# EAGLE design Temalab (EAGLE 9.2.2)
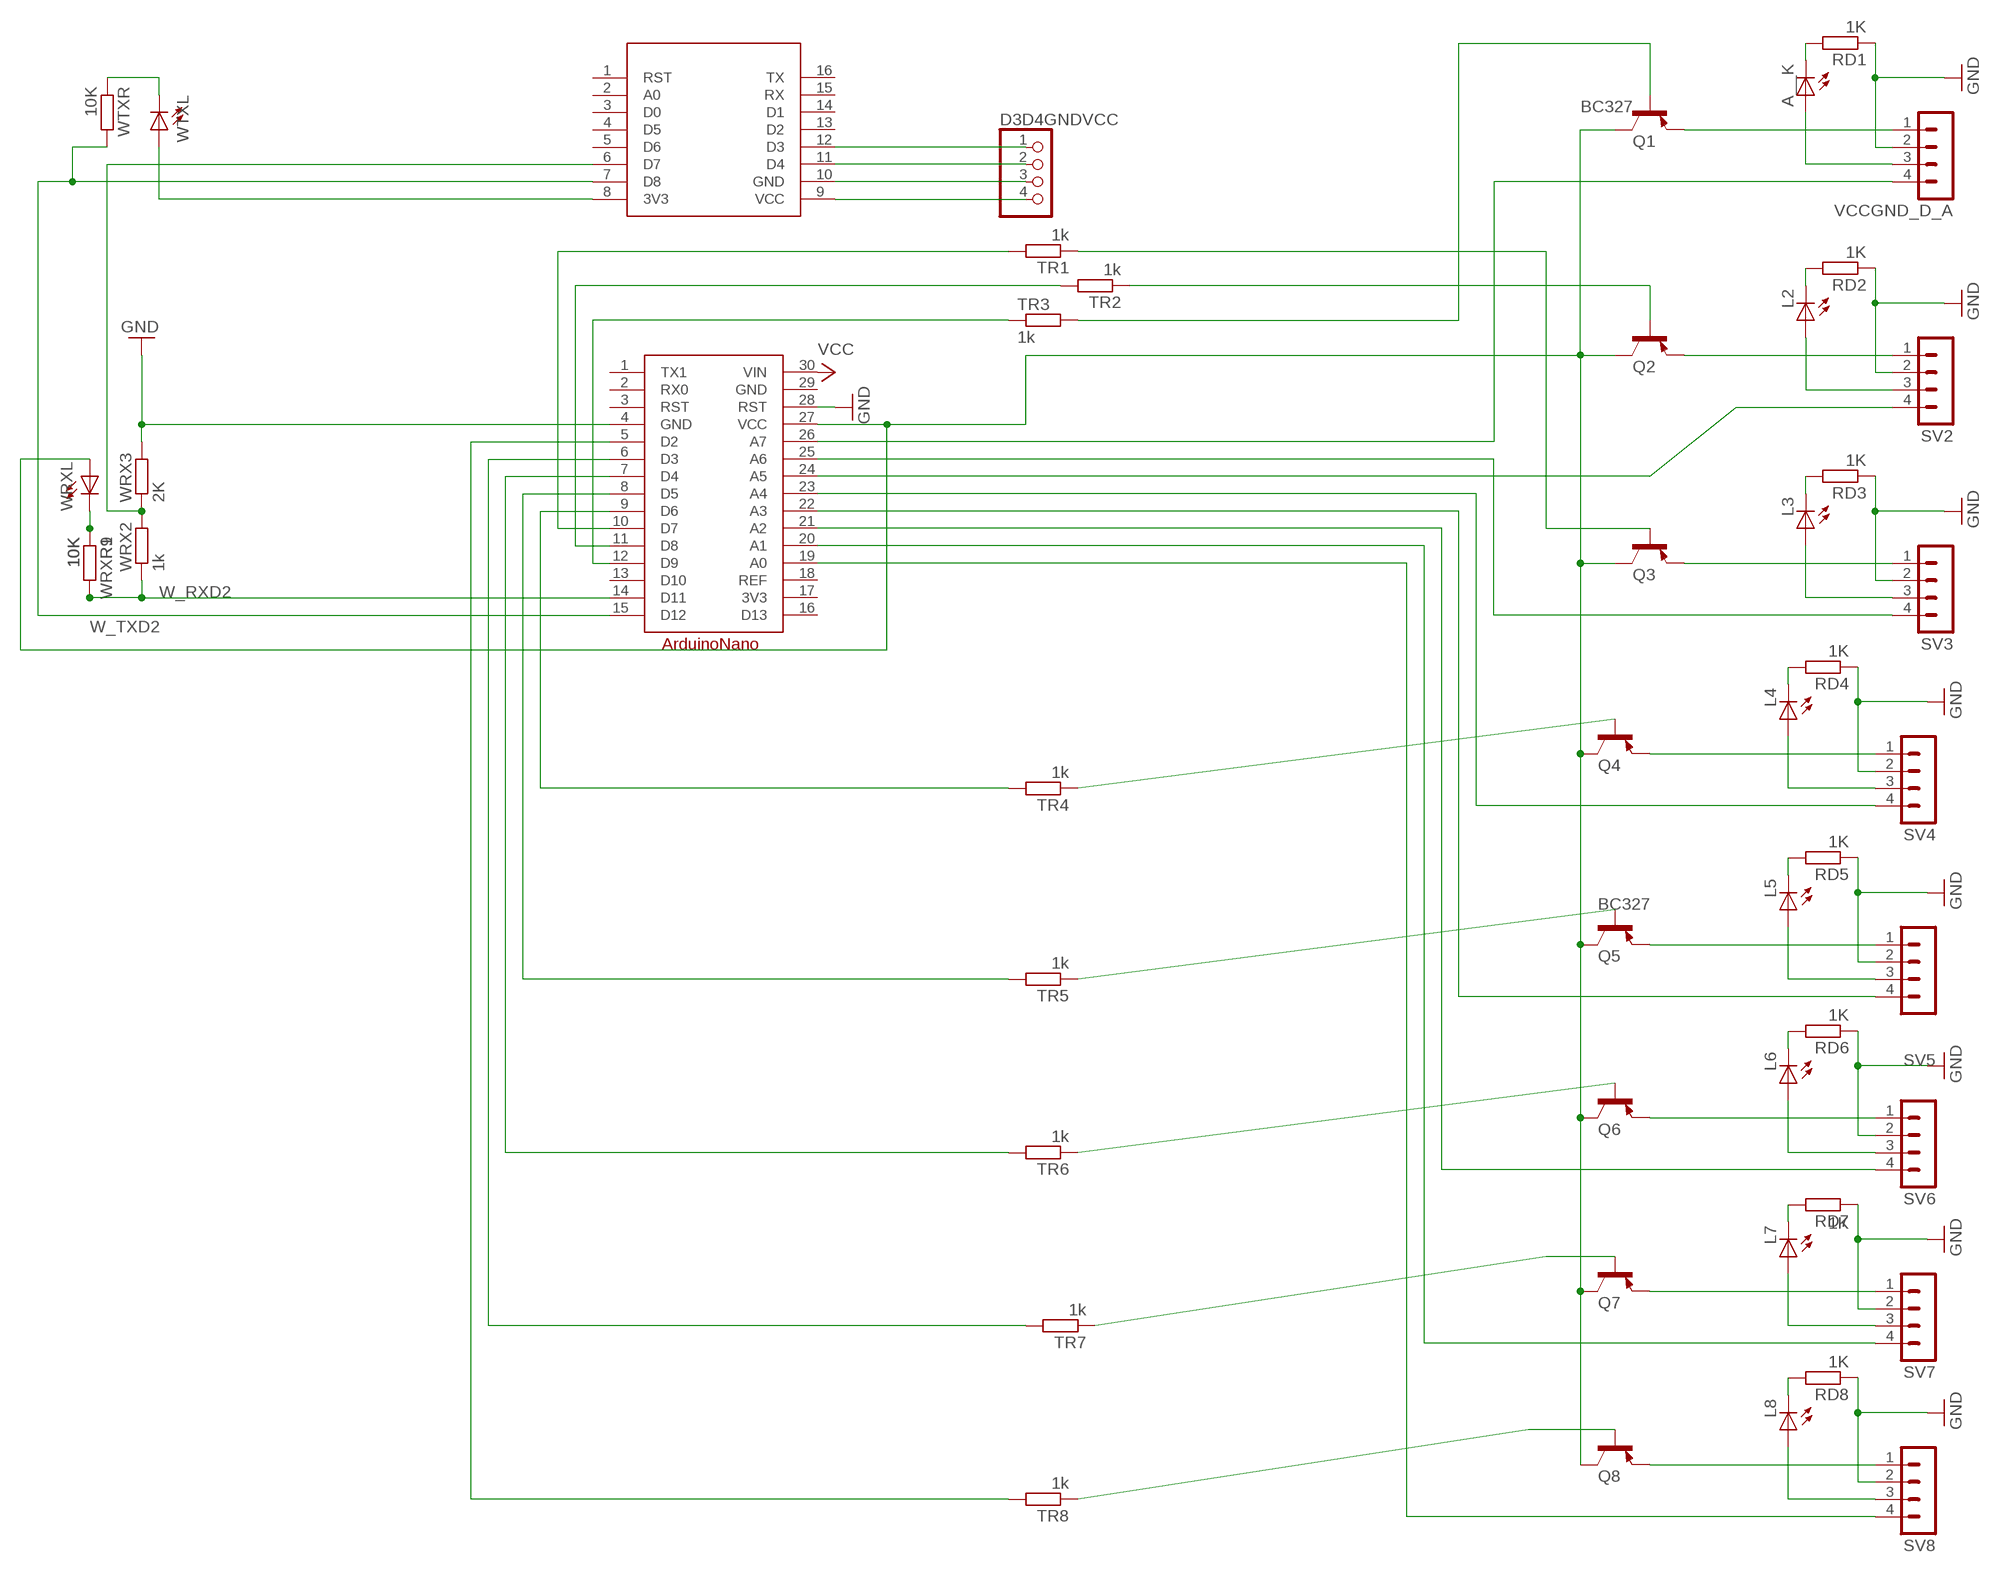
[diagram p0: schematic, sheet 1]

## Parts
A1  ARDUINONANO  [ARDUINONANO]
A__K  TLLR4400  [LED3MM]
D3D4GNDVCC  PINHD-1X4  [1X04]
L2  TLLR4400  [LED3MM]
L3  TLLR4400  [LED3MM]
L4  TLLR4400  [LED3MM]
L5  TLLR4400  [LED3MM]
L6  TLLR4400  [LED3MM]
L7  TLLR4400  [LED3MM]
L8  TLLR4400  [LED3MM]
Q1  BC327  [TO92]
Q2  BC327  [TO92]
Q3  BC327  [TO92]
Q4  BC327  [TO92]
Q5  BC327  [TO92]
Q6  BC327  [TO92]
Q7  BC327  [TO92]
Q8  BC327  [TO92]
R9  10K  R-EU_0204/2V  [0204V]
RD1  1K  R-EU_0204/2V  [0204V]
RD2  1K  R-EU_0204/2V  [0204V]
RD3  1K  R-EU_0204/2V  [0204V]
RD4  1K  R-EU_0204/2V  [0204V]
RD5  1K  R-EU_0204/2V  [0204V]
RD6  1K  R-EU_0204/2V  [0204V]
RD7  1K  R-EU_0204/2V  [0204V]
RD8  1K  R-EU_0204/2V  [0204V]
SV2  MA04-1  [MA04-1]
SV3  MA04-1  [MA04-1]
SV4  MA04-1  [MA04-1]
SV5  MA04-1  [MA04-1]
SV6  MA04-1  [MA04-1]
SV7  MA04-1  [MA04-1]
SV8  MA04-1  [MA04-1]
TR1  1k  R-EU_0204/5  [0204/5]
TR2  1k  R-EU_0204/5  [0204/5]
TR3  1k  R-EU_0204/5  [0204/5]
TR4  1k  R-EU_0204/5  [0204/5]
TR5  1k  R-EU_0204/5  [0204/5]
TR6  1k  R-EU_0204/5  [0204/5]
TR7  1k  R-EU_0204/5  [0204/5]
TR8  1k  R-EU_0204/5  [0204/5]
U$2  ESP8266MINI  [ESP8266MINI]
VCCGND_D_A  MA04-1  [MA04-1]
WRX2  1k  R-EU_0204/5  [0204/5]
WRX3  2K  R-EU_0204/5  [0204/5]
WRXL  TLLR4400  [LED3MM]
WRXR1  10K  R-EU_0204/2V  [0204V]
WTXL  A__K  TLLR4400  [LED3MM]
WTXR  10K  R-EU_0204/2V  [0204V]

## Nets
GND [GNDVCC]: A1.4(GND) A1.28(RST) D3D4GNDVCC.3 RD1.1 RD2.1 RD3.1 RD4.1 RD5.1 RD6.1 RD7.1 RD8.1 SV2.2 SV3.2 SV4.2 SV5.2 SV6.2 SV7.2 SV8.2 U$2.10(GND) VCCGND_D_A.2 WRX3.2
N$1: Q1.1(E) VCCGND_D_A.1
N$2: Q2.1(E) SV2.1
N$3: Q3.1(E) SV3.1
N$4: A1.12(D9) TR3.1
N$5: Q2.2(B) TR2.1
N$6: Q3.2(B) TR1.1
N$7: A1.26(A7) VCCGND_D_A.4
N$8: A1.24(A5) SV2.4
N$9: A1.25(A6) SV3.4
N$10: A1.27(VCC) Q1.3(C) Q2.3(C) Q3.3(C) Q4.3(C) Q5.3(C) Q6.3(C) Q7.3(C) Q8.3(C) WRXL.A
N$11: Q1.2(B) TR3.2
N$12: L2.A SV2.3
N$13: L2.K(C) RD2.2
N$14: R9.1 WRXL.K(C) WRXR1.1
N$15: Q4.2(B) TR4.1
N$16: U$2.8(3V3) WTXL.A
N$17: A1.11(D8) TR2.2
N$18: WTXL.K(C) WTXR.1
N$19: L3.A SV3.3
N$20: L3.K(C) RD3.2
N$21: U$2.6(D7) WRX2.2 WRX3.1
N$22: A__K.A VCCGND_D_A.3
N$23: A__K.K(C) RD1.2
N$24: D3D4GNDVCC.1 U$2.12(D3)
N$25: D3D4GNDVCC.2 U$2.11(D4)
N$26: Q4.1(E) SV4.1
N$27: Q5.1(E) SV5.1
N$28: A1.19(A0) SV8.4
N$29: A1.20(A1) SV7.4
N$30: L7.A SV7.3
N$31: L8.A SV8.3
N$32: L8.K(C) RD8.2
N$33: Q6.1(E) SV6.1
N$34: L7.K(C) RD7.2
N$35: Q7.1(E) SV7.1
N$36: Q8.1(E) SV8.1
N$37: A1.21(A2) SV6.4
N$38: L6.A SV6.3
N$39: L6.K(C) RD6.2
N$42: A1.9(D6) TR4.2
N$43: L5.A SV5.3
N$44: L5.K(C) RD5.2
N$47: A1.23(A4) SV4.4
N$48: L4.A SV4.3
N$49: L4.K(C) RD4.2
N$51: A1.8(D5) TR5.2
N$52: A1.22(A3) SV5.4
N$53: A1.7(D4) TR6.2
N$54: A1.6(D3) TR7.2
N$55: A1.5(D2) TR8.2
N$56: A1.10(D7) TR1.2
N$57: Q5.2(B) TR5.1
N$58: Q6.2(B) TR6.1
N$59: Q7.2(B) TR7.1
N$60: Q8.2(B) TR8.1
VCC [GNDVCC]: A1.30(VIN) D3D4GNDVCC.4 U$2.9(VCC)
W_RXD2: A1.14(D11) R9.2 WRX2.1 WRXR1.2
W_TXD2: A1.15(D12) U$2.7(D8) WTXR.2
Unconnected: A1.1(TX1) A1.2(RX0) A1.3(RST) A1.13(D10) A1.16(D13) U$2.1(RST) U$2.2(A0) U$2.3(D0) U$2.4(D5) U$2.5(D6) U$2.13(D2) U$2.14(D1) U$2.15(RX) U$2.16(TX)

## Power pins joined to a net without a drawn wire
3V3: A1.17(3V3)
GND: A1.29(GND)
REF: A1.18(REF)

## Library data of the parts
A1 = ArduinoNano:ARDUINONANO
A__K L2-L8 WRXL WTXL = led:TLLR4400: Low Current (2mA) LED 3 mm Tinted Diffused Package color RED Source: Data sheet <http://www.farnell.com/datasheets/391100.pdf>; MF: VISHAY SEMICONDUCTOR; OC_FARNELL: 1612437
D3D4GNDVCC = pinhead:PINHD-1X4: PIN HEADER
Q1-Q8 = transistor-pnp:BC327: PNP Transistor
R9 RD1-RD8 WRXR1 WTXR = rcl:R-EU_: RESISTOR, European symbol; SPICEPREFIX: R
SV2-SV8 VCCGND_D_A = con-lstb:MA04-1: PIN HEADER; OC_FARNELL: unknown; OC_NEWARK: unknown
TR1-TR8 WRX2 WRX3 = resistor:R-EU_: RESISTOR, European symbol
U$2 = ESP8266mini:ESP8266MINI

## Net classes
0 default: width 0.4 mm
1 GNDVCC: width 0.6 mm
2 supply: width 0.4 mm

## Board
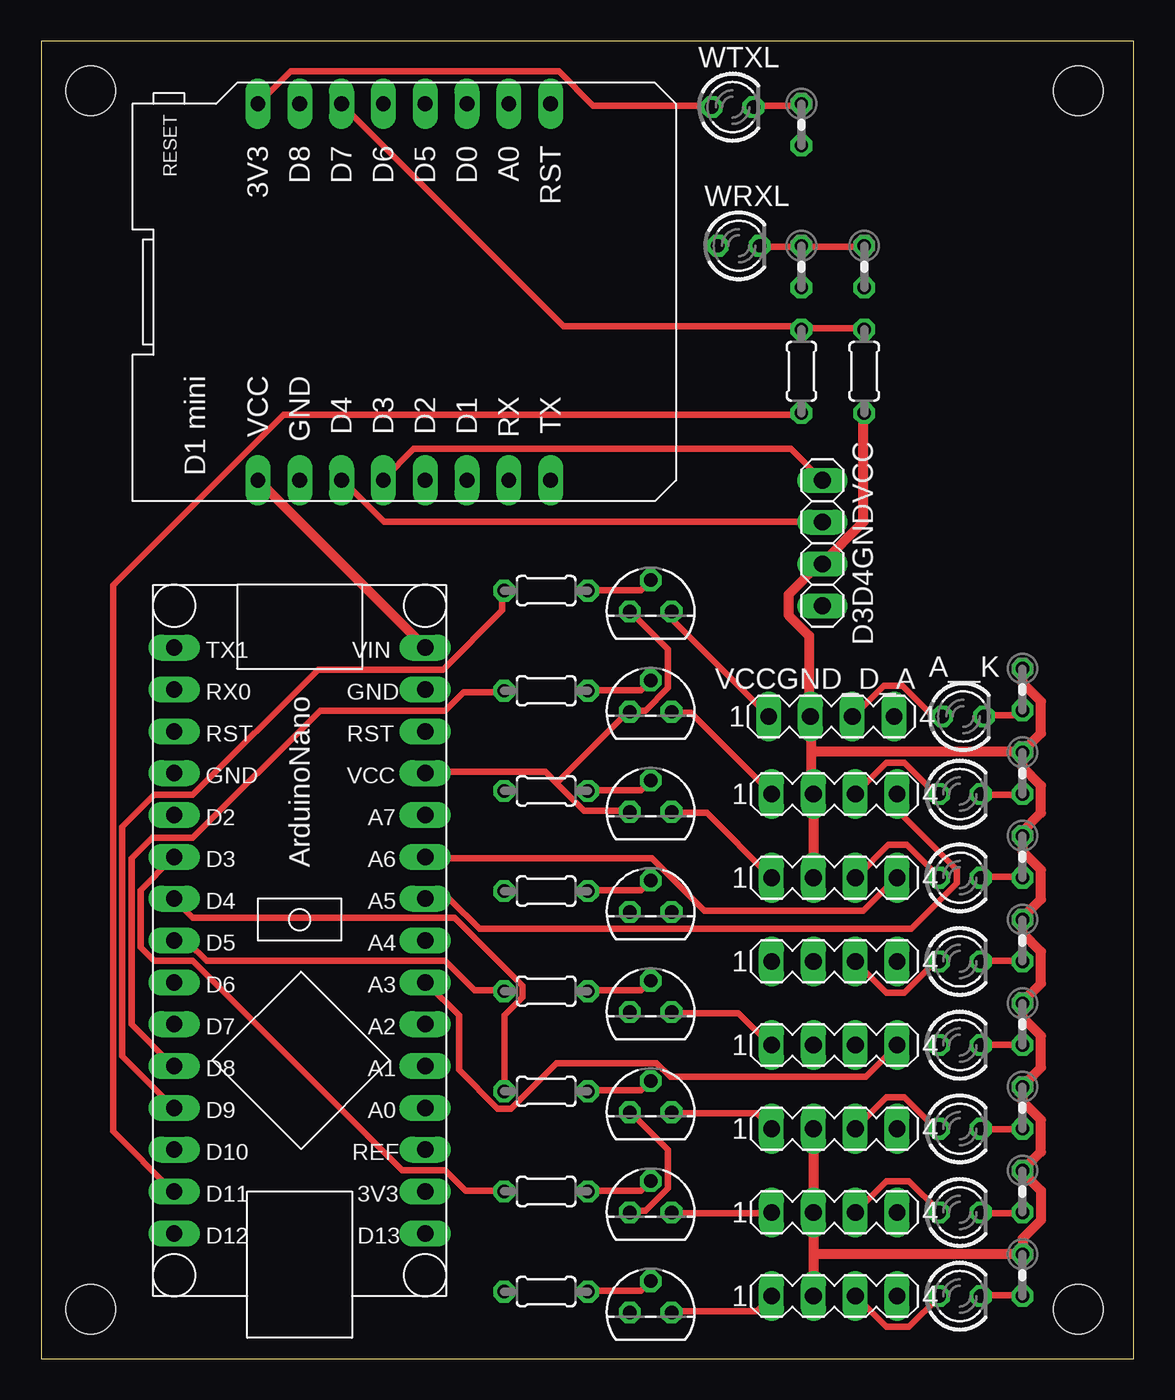
[diagram p1: board, top side]
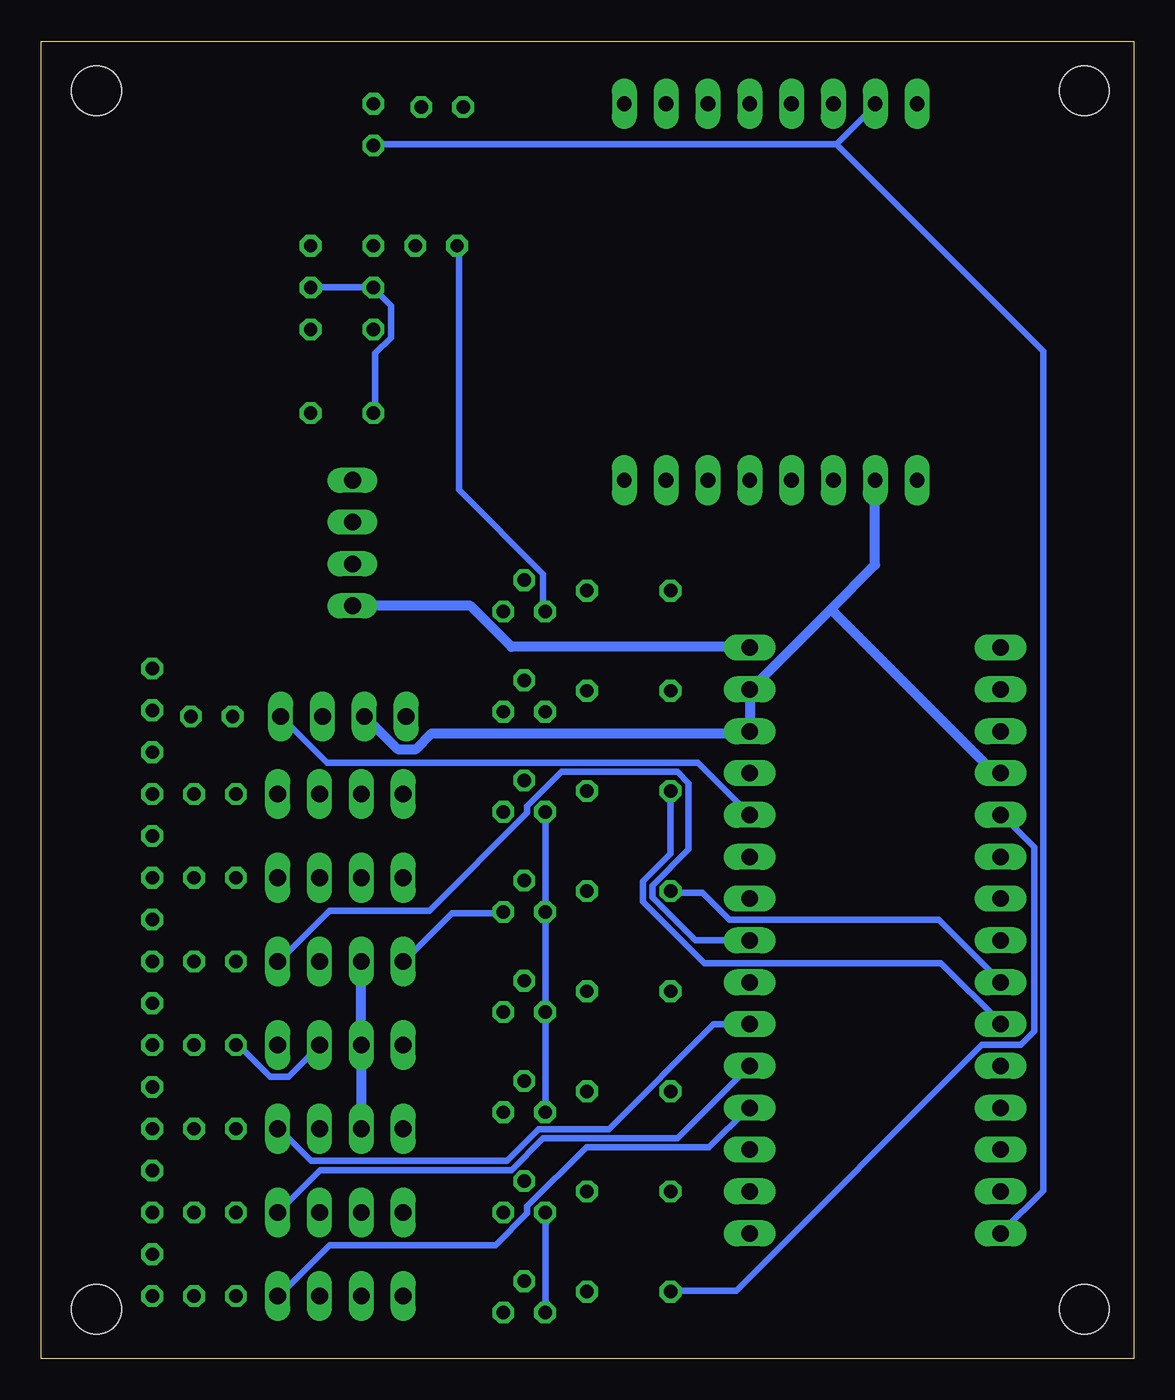
[diagram p2: board, bottom side, seen from below]

Size 66.36 x 80 mm. Coordinates in mm from the lower left corner, seen from the top.
Outline: 0,0 66.36,0 66.36,80 0,80 0,0
Copper layers (1*16): Top 0.035mm / dielectric 1.5mm / Bottom 0.035mm
Design rules "default": minimum track width 6mil, minimum drill 0.35mm, track to track 6mil, track to pad 6mil, pad to pad 6mil, via to via 6mil, smd to smd 6mil, copper to edge 40mil, drill to drill 6mil, minimum pad ring 10mil, minimum via ring 8mil, stop-mask expansion 4mil, vias tented up to drill 0mil, thermal gap 10mil
Holes 3 mm at 3,3 3,77 63,3 63,77

### Footprints (pad centres in the part's own frame; a part is rotated, then mirrored left to right if it is on the bottom)
ARDUINONANO = drill 1 pad 1.575 long: 1 -7.62,16.51; 2 -7.62,13.97; 3 -7.62,11.43; 4 -7.62,8.89; 5 -7.62,6.35; 6 -7.62,3.81; 7 -7.62,1.27; 8 -7.62,-1.27; 9 -7.62,-3.81; 10 -7.62,-6.35; 11 -7.62,-8.89; 12 -7.62,-11.43; 13 -7.62,-13.97; 14 -7.62,-16.51; 15 -7.62,-19.05; 16 7.62,-19.05; 17 7.62,-16.51; 18 7.62,-13.97; 19 7.62,-11.43; 20 7.62,-8.89; 21 7.62,-6.35; 22 7.62,-3.81; 23 7.62,-1.27; 24 7.62,1.27; 25 7.62,3.81; 26 7.62,6.35; 27 7.62,8.89; 28 7.62,11.43; 29 7.62,13.97; 30 7.62,16.51
LED3MM = drill 0.813 octagon: A -1.27,0; K 1.27,0
1X04 = drill 1.016 long: 1 -3.81,0; 2 -1.27,0; 3 1.27,0; 4 3.81,0
TO92 = drill 0.813 octagon: 1 1.27,0; 2 0,1.905; 3 -1.27,0
0204V = drill 0.813 octagon: 1 -1.27,0; 2 1.27,0
MA04-1 = drill 1.016 long: 1 -3.81,0; 2 -1.27,0; 3 1.27,0; 4 3.81,0
0204/5 = drill 0.813 octagon: 1 -2.54,0; 2 2.54,0
ESP8266MINI = drill 0.9 pad 1.524 long: 1 -11.43,8.89; 2 -11.43,6.35; 3 -11.43,3.81; 4 -11.43,1.27; 5 -11.43,-1.27; 6 -11.43,-3.81; 7 -11.43,-6.35; 8 -11.43,-8.89; 9 11.43,-8.89; 10 11.43,-6.35; 11 11.43,-3.81; 12 11.43,-1.27; 13 11.43,1.27; 14 11.43,3.81; 15 11.43,6.35; 16 11.43,8.89

### Placement (x,y rotation side)
A1  15.7,26.67 0 top
A__K  56,39 0 top
D3D4GNDVCC  47.45,49.53 270 top
L2  55.8,34.29 0 top
L3  55.8,29.21 0 top
L4  55.8,24.13 0 top
L5  55.8,19.05 0 top
L6  55.8,13.97 0 top
L7  55.8,8.89 0 top
L8  55.8,3.81 0 top
Q1  37.02,45.37 0 top
Q2  37.02,39.29 0 top
Q3  37.02,33.21 0 top
Q4  37.02,27.13 0 top
Q5  37.02,21.05 0 top
Q6  37.02,14.97 0 top
Q7  37.02,8.89 0 top
Q8  37.02,2.81 0 top
R9  49.99,66.31 270 top
RD1  59.61,40.64 270 top
RD2  59.61,35.56 270 top
RD3  59.61,30.48 270 top
RD4  59.61,25.4 270 top
RD5  59.61,20.32 270 top
RD6  59.61,15.24 270 top
RD7  59.61,10.16 270 top
RD8  59.61,5.08 270 top
SV2  48.18,34.29 0 top
SV3  48.18,29.21 0 top
SV4  48.18,24.13 0 top
SV5  48.18,19.05 0 top
SV6  48.18,13.97 0 top
SV7  48.18,8.89 0 top
SV8  48.18,3.81 0 top
TR1  30.67,34.48 180 top
TR2  30.67,40.56 180 top
TR3  30.67,46.64 0 top
TR4  30.67,28.4 180 top
TR5  30.67,22.32 180 top
TR6  30.67,16.24 180 top
TR7  30.67,10.16 180 top
TR8  30.67,4.08 180 top
U$2  22.05,64.77 270 top
VCCGND_D_A  48,39 0 top
WRX2  46.18,59.96 90 top
WRX3  49.99,59.96 270 top
WRXL  42.37,67.58 0 top
WRXR1  46.18,66.31 270 top
WTXL  42,76 0 top
WTXR  46.18,74.93 270 top

### Tracks (layer width: path | path; a pad name or v marks a point on that pad's centre or on a via)
GND
  Top 0.6: SV3.2 46.92,29.28 46.92,34.25 SV2.2 46.78,34.52 46.78,36.87 | 46.78,36.87 46.78,38.94 VCCGND_D_A.2 46.64,39.22 46.64,43.92 45.4,45.16 45.4,46.4 47.19,48.2 D3D4GNDVCC.3 47.47,48.34 49.95,50.82 49.95,57.31 WRX3.2 | 46.92,6.35 46.92,8.84 SV7.2 46.92,9.12 46.92,13.95 SV6.2 | 46.92,6.35 46.92,3.87 SV8.2 | RD2.1 59.62,36.73 59.62,35.91 60.73,34.8 60.73,33.14 59.62,32.04 RD3.1 59.62,31.62 59.62,30.8 60.73,29.69 60.73,27.9 59.76,26.93 RD4.1 59.62,26.65 59.62,25.82 60.73,24.72 60.73,22.79 59.76,21.82 RD5.1 59.62,21.54 59.62,20.71 60.73,19.61 60.73,17.68 59.76,16.71 RD6.1 59.62,16.43 59.62,15.61 60.73,14.5 60.73,12.57 59.76,11.6 RD7.1 59.62,11.32 60.73,10.22 60.73,8.42 59.62,7.32 59.62,6.35 RD8.1 59.34,6.35 46.92,6.35 | RD1.1 59.62,41.84 59.62,41.02 60.73,39.91 60.73,37.98 59.76,37.01 RD2.1 | 46.78,36.87 59.34,36.87 RD2.1
  Bottom 0.6: 18.4,45.5 23.3,40.6 A1.29 23.3,40.33 23.3,38.12 A1.28 23.58,37.98 42.63,37.98 43.6,37.01 44.71,37.01 46.64,38.94 VCCGND_D_A.2 | 18.4,45.5 15.71,48.2 15.71,53.31 U$2.10 | 18.4,45.5 8.52,35.63 8.11,35.63 A1.4 | SV6.2 46.92,14.09 46.92,18.92 SV5.2 46.92,19.33 46.92,24.03 SV4.2
N$1
  Top 0.4: Q1.1 38.35,45.3 38.35,44.88 44.15,39.08 VCCGND_D_A.1
N$2
  Top 0.4: Q2.1 38.35,39.22 39.46,39.22 44.29,34.39 SV2.1
N$3
  Top 0.4: Q3.1 38.35,33.14 40.42,33.14 44.29,29.28 SV3.1
N$4
  Top 0.4: TR3.1 28,46.54 28,45.44 24.41,41.84 16.81,41.84 9.21,34.25 6.87,34.25 4.93,32.31 4.93,18.37 7.97,15.33 A1.12
N$5
  Top 0.4: TR2.1 33.24,40.6 36.42,40.6 36.97,41.15 Q2.2
N$6
  Top 0.4: TR1.1 33.24,34.52 36.42,34.52 36.97,35.08 Q3.2
N$7
  Bottom 0.4: VCCGND_D_A.4 51.75,38.94 48.99,36.18 26.48,36.18 23.44,33.14 A1.26
N$8
  Top 0.4: SV2.4 52.03,34.25 52.03,33.28 55.62,29.69 55.62,28.86 52.85,26.1 26.61,26.1 24.82,27.9 23.44,27.9 A1.24
N$9
  Top 0.4: SV3.4 51.89,29.14 49.95,27.21 40.29,27.21 37.11,30.38 23.44,30.38 A1.25
N$10
  Top 0.4: Q1.3 35.87,45.3 38.08,43.09 38.08,40.74 36.7,39.36 35.87,39.36 Q2.3 35.59,39.22 31.31,34.94 | Q7.3 35.87,8.98 36.7,8.98 38.08,10.36 38.08,12.71 35.87,14.91 Q6.3 | 31.31,34.94 32.97,33.28 35.73,33.28 Q3.3 | 31.31,34.94 30.62,35.63 23.44,35.63 A1.27
  Bottom 0.4: WRXL.A 40.98,67.53 40.98,52.75 35.87,47.65 35.87,45.44 Q1.3 | Q8.3 35.73,2.9 35.73,8.84 Q7.3 | Q6.3 35.73,15.05 35.73,20.99 Q5.3 35.73,21.13 35.73,26.93 Q4.3 35.73,27.21 35.73,33.14 Q3.3
N$11
  Top 0.4: TR3.2 33.24,46.68 36.42,46.68 36.97,47.23 Q1.2
N$12
  Top 0.4: L2.A 54.51,34.39 54.23,34.39 52.44,36.18 51.34,36.18 49.54,34.39 SV2.3
N$13
  Top 0.4: L2.K 57.13,34.25 59.48,34.25 RD2.2
N$14
  Top 0.4: WRXL.K 43.74,67.53 46.09,67.53 WRXR1.1 46.36,67.53 49.95,67.53 R9.1
N$15
  Top 0.4: TR4.1 33.24,28.45 36.42,28.45 36.97,29 Q4.2
N$16
  Top 0.4: WTXL.A 40.7,76.09 33.52,76.09 31.45,78.17 15.15,78.17 13.22,76.23 U$2.8
N$17
  Top 0.4: TR2.2 28,40.46 25.65,40.46 24.54,39.36 16.95,39.36 9.21,31.62 6.73,31.62 5.49,30.38 5.49,20.3 7.97,17.82 A1.11
N$18
  Top 0.4: WTXL.K 43.33,76.09 46.09,76.09 WTXR.1
N$19
  Top 0.4: L3.A 54.51,29.28 52.58,31.21 51.47,31.21 49.54,29.28 SV3.3
N$20
  Top 0.4: L3.K 57.13,29.28 59.48,29.28 RD3.2
N$21
  Top 0.4: WRX3.1 49.95,62.56 46.23,62.56 WRX2.2 46.09,62.7 31.73,62.7 18.33,76.09 U$2.6
N$22
  Top 0.4: A__K.A 54.65,39.08 54.1,39.08 52.3,40.88 51.2,40.88 49.4,39.08 VCCGND_D_A.3
N$23
  Top 0.4: A__K.K 57.27,39.08 59.21,39.08 59.48,39.36 RD1.2
N$24
  Top 0.4: U$2.12 20.82,53.45 22.61,55.24 45.53,55.24 47.33,53.45 D3D4GNDVCC.1
N$25
  Top 0.4: D3D4GNDVCC.2 47.33,50.82 20.82,50.82 18.33,53.31 U$2.11
N$26
  Bottom 0.4: Q4.1 38.35,27.07 41.39,27.07 44.29,24.17 SV4.1
N$27
  Top 0.4: Q5.1 38.35,20.99 42.36,20.99 44.29,19.06 SV5.1
N$28
  Bottom 0.4: SV8.4 51.89,3.87 48.85,6.91 38.77,6.91 36.83,8.84 36.83,9.25 33.24,12.84 25.79,12.84 23.44,15.19 A1.19
N$29
  Bottom 0.4: SV7.4 51.89,8.98 49.4,11.46 37.8,11.46 35.87,13.4 27.72,13.4 23.44,17.68 A1.20
N$30
  Top 0.4: L7.A 54.51,8.98 52.72,10.77 51.34,10.77 49.54,8.98 SV7.3
N$31
  Top 0.4: L8.A 54.51,3.73 52.72,1.93 51.34,1.93 49.54,3.73 SV8.3
N$32
  Top 0.4: L8.K 57.13,3.87 59.48,3.87 RD8.2
N$33
  Top 0.4: Q6.1 38.35,14.91 43.46,14.91 44.29,14.09 SV6.1
N$34
  Top 0.4: L7.K 57.13,8.84 59.48,8.84 RD7.2
N$35
  Top 0.4: Q7.1 38.35,8.84 44.29,8.84 SV7.1
N$36
  Top 0.4: Q8.1 38.35,2.9 43.46,2.9 44.29,3.73 SV8.1
N$37
  Bottom 0.4: SV6.4 51.89,13.95 49.95,12.02 38.08,12.02 36.14,13.95 31.86,13.95 25.51,20.3 23.44,20.3 A1.21
N$38
  Top 0.4: L6.A 54.51,14.09 54.23,14.09 52.44,15.88 51.34,15.88 49.54,14.09 SV6.3
N$39
  Top 0.4: L6.K 57.13,13.95 59.48,13.95 RD6.2
N$42
  Bottom 0.4: TR4.2 28,28.31 26.2,28.31 24.54,26.65 11.84,26.65 8.11,22.93 A1.9
N$43
  Bottom 0.4: L5.A 54.51,18.92 54.23,18.92 52.44,17.12 51.34,17.12 49.54,18.92 SV5.3
N$44
  Top 0.4: L5.K 57.13,19.06 59.48,19.06 RD5.2
N$47
  Bottom 0.4: SV4.4 51.89,24.17 48.85,27.21 42.77,27.21 36.83,33.14 36.83,33.56 34.76,35.63 27.72,35.63 27.03,34.94 27.03,30.93 29.24,28.73 29.24,28.03 26.61,25.41 23.44,25.41 A1.23
N$48
  Top 0.4: L4.A 54.51,24.03 54.23,24.03 52.44,22.23 51.34,22.23 49.54,24.03 SV4.3
N$49
  Top 0.4: L4.K 57.13,24.17 59.48,24.17 RD4.2
N$51
  Top 0.4: TR5.2 28,22.37 26.34,22.37 24.54,24.17 10.04,24.17 8.94,25.27 8.11,25.27 A1.8
N$52
  Top 0.4: SV5.4 51.89,18.92 50.09,17.12 38.22,17.12 37.39,17.95 31.31,17.95 28.55,15.19 27.72,15.19 25.37,17.54 25.37,20.85 23.44,22.79 A1.22
N$53
  Top 0.4: TR6.2 28.13,16.3 28.13,20.85 29.24,21.96 29.24,22.65 25.1,26.79 9.21,26.79 8.11,27.9 A1.7
N$54
  Top 0.4: TR7.2 28,10.22 25.79,10.22 24.54,11.46 21.92,11.46 9.21,24.17 6.87,24.17 6.04,25 6.04,28.45 7.97,30.38 A1.6
N$55
  Bottom 0.4: TR8.2 28,4.14 24.13,4.14 9.21,19.06 6.87,19.06 6.04,19.89 6.04,31.07 7.97,33.01 A1.5
N$56
  Bottom 0.4: TR1.2 28.13,34.39 28.13,30.66 29.79,29 29.79,27.76 26.06,24.03 11.7,24.03 8.11,20.44 A1.10
N$57
  Top 0.4: TR5.1 33.24,22.37 36.42,22.37 36.97,22.93 Q5.2
N$58
  Top 0.4: TR6.1 33.24,16.3 36.42,16.3 36.97,16.85 Q6.2
N$59
  Top 0.4: TR7.1 33.24,10.22 36.42,10.22 36.97,10.77 Q7.2
N$60
  Top 0.4: TR8.1 33.24,4.14 36.42,4.14 36.97,4.7 Q8.2
VCC
  Top 0.6: U$2.9 13.22,53.31 23.3,43.23 A1.30
  Bottom 0.6: D3D4GNDVCC.4 47.33,45.71 40.29,45.71 37.8,43.23 23.44,43.23 A1.30
W_RXD2
  Top 0.4: A1.14 7.97,10.22 4.38,13.81 4.38,46.95 14.74,57.31 46.09,57.31 WRX2.1
  Bottom 0.4: WRX2.1 46.09,57.45 46.09,61.04 45.12,62.01 45.12,63.94 46.09,64.91 WRXR1.2 46.36,65.05 49.95,65.05 R9.2
W_TXD2
  Bottom 0.4: 18.05,73.75 46.09,73.75 WTXR.2 | 18.05,73.75 15.71,76.09 U$2.7 | 18.05,73.75 5.49,61.18 5.49,10.22 7.97,7.73 A1.15